# Altium schematic sheet 1_P1.schdoc
size 307 x 218 mm; Symbol: Drawing-Symbol_A4; Device: Drawing-Symbol_A4; Company: 嘉立创EDA; Version: V1.0; Page Size: A4; @Project Name: 瑞萨开发板; @Page Count: 1; @Update Date: 2025-09-14; @Create Date: 2025-09-13; @Schematic Name: Schematic1; @Page No: 1; @Page Name: P1; @Create Time: 13:29:17; @Update Time: 19:17:57; Width: 1170; Height: 825; Region Start: 1; X Region Count: 6; Y Region Count: 4; Blade Width: 10; Title Block Position: 3; @Board Name: Board1
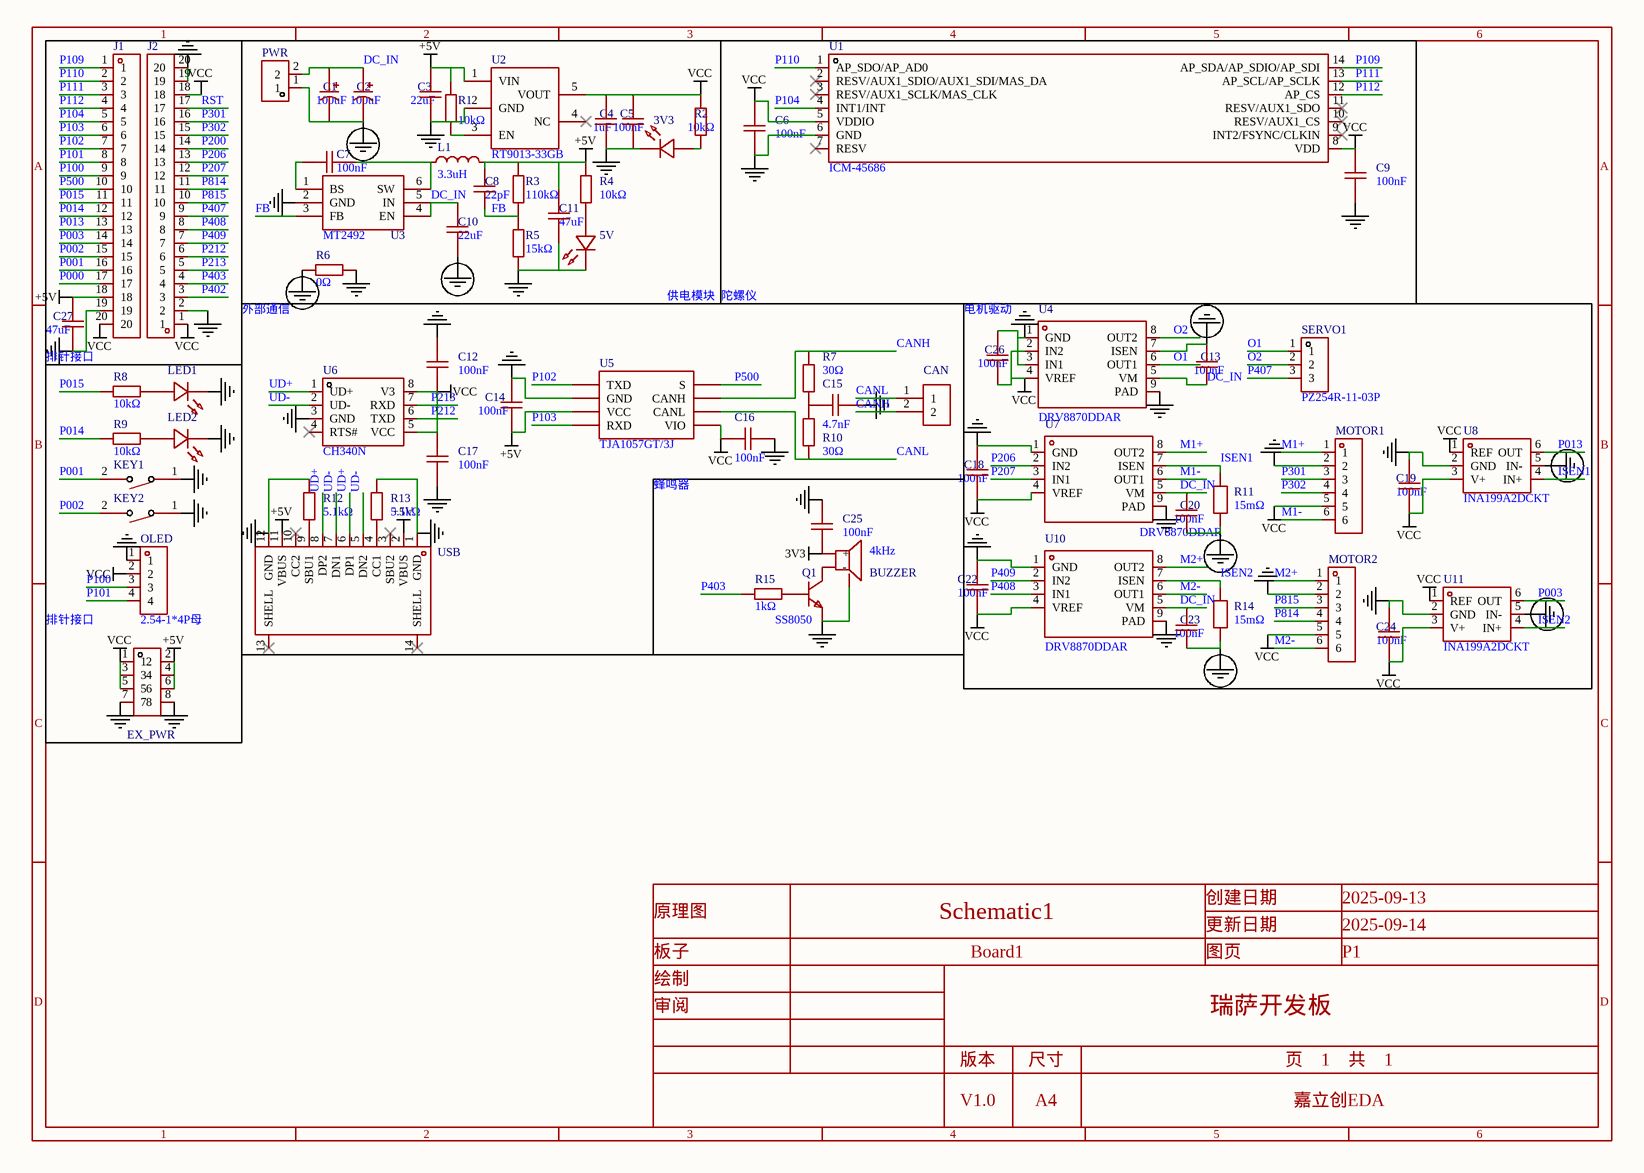
[diagram p0: 1_P1.schdoc]

## Parts
3V3  XL-1608SURC-06  [LED0603-RD_RED]  (value not drawn)
5V  XL-1608SURC-06  [LED0603-RD_RED]  (value not drawn)
BUZZER  4kHz  [BUZ-SMD_L5.0-W5.5-P4.60]
C1  100uF  [CAP-SMD_BD8.1-L8.3-W8.3-LS9.3-FD]
C2  100uF  [CAP-SMD_BD8.1-L8.3-W8.3-LS9.3-FD]
C3  22uF  [C0603]
C4  1uF  [C0603]
C5  100nF  [C0603]
C6  100nF  [C0603]
C7  100nF  [C0603]
C8  22pF  [C0603]
C9  100nF  [C0603]
C10  22uF  [C0805]
C11  47uF  [C0805]
C12  100nF  [C0603]
C13  100nF  [C0805]
C14  100nF  [C0805]
C15  4.7nF  [C0603]
C16  100nF  [C0603]
C17  100nF  [C0603]
C18  100nF  [C0603]
C19  100nF  [C0603]
C20  100nF  [C0805]
C22  100nF  [C0603]
C23  100nF  [C0805]
C24  100nF  [C0603]
C25  100nF  [C0603]
C26  100nF  [C0603]
C27  47uF  [C0805]
CAN  WJ500V-5.08-2P  [CONN-TH_2P-P5.00_WJ500V-5.08-2P]  (value not drawn)
EX_PWR  PZ254V-12-8P  [HDR-TH_8P-P2.54-V-M-R2-C4-S2.54]  (value not drawn)
J1  ZX-PM2.54-1-20PY  [HDR-TH_20P-P2.54-V-F]  (value not drawn)
J2  ZX-PM2.54-1-20PY  [HDR-TH_20P-P2.54-V-F]  (value not drawn)
KEY1  TS-1088-AR02016  [SW-SMD_L3.9-W3.0-P4.45]  (value not drawn)
KEY2  TS-1088-AR02016  [SW-SMD_L3.9-W3.0-P4.45]  (value not drawn)
L1  3.3uH  [IND-SMD_L7.1-W6.6_MJC-0603T]
LED1  XL-1608SURC-06  [LED0603-RD_RED]  (value not drawn)
LED2  XL-1608SURC-06  [LED0603-RD_RED]  (value not drawn)
MOTOR1  ZX-XH2.54-6PWZ  [CONN-TH_6P-P2.50_ZX-XH2.54-6PWZ]  (value not drawn)
MOTOR2  ZX-XH2.54-6PWZ  [CONN-TH_6P-P2.50_ZX-XH2.54-6PWZ]  (value not drawn)
OLED  2.54-1*4P母  [HDR-TH_4P-P2.54-V-F]
PWR  PZ254V-11-02P  [HDR-TH_2P-P2.54-V-M]  (value not drawn)
Q1  SS8050  [SOT-23-3_L2.9-W1.3-P1.90-LS2.4-BR]
R1  10kΩ  [R0603]
R2  10kΩ  [R0603]
R3  110kΩ  [R0402]
R4  10kΩ  [R0603]
R5  15kΩ  [R0402]
R6  0Ω  [R0603]
R7  30Ω  [R0603]
R8  10kΩ  [R0603]
R9  10kΩ  [R0603]
R10  30Ω  [R0603]
R11  15mΩ  [RES-SMD_L6.4-W3.2-R2512]
R12  5.1kΩ  [R0402]
R13  5.1kΩ  [R0402]
R14  15mΩ  [RES-SMD_L6.4-W3.2-R2512]
R15  1kΩ  [R0603]
SERVO1  PZ254R-11-03P  [HDR-TH_3P-P2.54-H-M-W10.4]
U1  ICM-45686  [LGA-14_L3.0-W2.5-P0.50-TL]
U2  RT9013-33GB  [SOT-23-5_L3.0-W1.7-P0.95-LS2.8-BL]
U3  MT2492  [SOT-23-6_L2.9-W1.6-P0.95-LS2.8-BL_3]
U4  DRV8870DDAR  [HSOP-8_L5.0-W4.0-P1.27-LS6.2-BL-EP]
U5  TJA1057GT/3J  [SOIC-8_L4.9-W3.9-P1.27-LS6.0-BL]
U6  CH340N  [SOP-8_L4.9-W3.9-P1.27-LS6.0-BL]
U7  DRV8870DDAR  [HSOP-8_L5.0-W4.0-P1.27-LS6.2-BL-EP]
U8  INA199A2DCKT  [SC-70-6_L2.0-W1.3-P0.65-LS2.1-BR]
U10  DRV8870DDAR  [HSOP-8_L5.0-W4.0-P1.27-LS6.2-BL-EP]
U11  INA199A2DCKT  [SC-70-6_L2.0-W1.3-P0.65-LS2.1-BR]
USB  TYPE-C 16PIN 2MD(073)  [USB-C-SMD_TYPE-C-6PIN-2MD-073]  (value not drawn)

## Blocks framed on the sheet
排针接口: C27 J1 J2
供电模块: 3V3 5V C1-C5 C7 C8 C10 C11 L1 PWR R1-R6 U2 U3
陀螺仪: C6 C9 U1
外部通信: C12 C14-C17 CAN R7 R10 R12 R13 U5 U6 USB
电机驱动: C13 C18-C20 C22-C24 C26 MOTOR1 MOTOR2 R11 R14 SERVO1 U4 U7 U8 U10 U11
排针接口: EX_PWR KEY1 KEY2 LED1 LED2 OLED R8 R9
蜂鸣器: BUZZER C25 Q1 R15

## Nets
3V3: BUZZER.1(+) C25.2
+5V: C3.1 C8.2 C11.2 C14.1 C27.2 EX_PWR.2 EX_PWR.4 EX_PWR.6 J1.18 L1.2 R1.1 R3.2 R4.2 U2.1(VIN) U5.3(VCC) USB.2(VBUS) USB.11(VBUS)
GND: 3V3.1(K) 5V.1(K) BUZZER.3(NC) C3.2 C4.1 C5.1 C6.1 C9.1 C11.1 C12.2 C14.2 C15.2 C16.1 C17.1 C18.2 C19.2 C22.2 C24.2 C25.1 C26.2 C27.1 EX_PWR.7 EX_PWR.8 J1.19 J2.2 J2.19 J2.20 KEY1.1 KEY2.1 LED1.1(K) LED2.1(K) MOTOR1.2 MOTOR2.2 OLED.1 Q1.2(E) R5.1 R6.2 R12.1 R13.1 U1.6(GND) U2.2(GND) U3.2(GND) U4.1(GND) U4.3(IN1) U4.9(PAD) U5.2(GND) U6.3(GND) U7.1(GND) U7.9(PAD) U8.2(GND) U10.1(GND) U10.9(PAD) U11.2(GND) USB.1(GND) USB.12(GND)
PGND: C1.2 C2.2 C10.1 C13.2 C20.1 C23.1 PWR.1 R6.1 R11.1 R14.1 U4.7(ISEN) U8.5(IN-) U11.5(IN-)
VCC: C4.2 C5.2 C6.2 C9.2 C12.1 C16.2 C17.2 C18.1 C19.1 C22.1 C24.1 C26.1 EX_PWR.1 EX_PWR.3 EX_PWR.5 J1.20 J2.1 J2.18 MOTOR1.5 MOTOR2.5 OLED.2 R2.2 U1.5(VDDIO) U1.8(VDD) U2.5(VOUT) U4.2(IN2) U4.4(VREF) U5.5(VIO) U6.5(VCC) U6.8(V3) U7.4(VREF) U8.1(REF) U8.3(V+) U10.4(VREF) U11.1(REF) U11.3(V+)
CANH: CAN.2 R7.2 U5.7(CANH)
CANL: CAN.1 R10.1 U5.6(CANL)
DC_IN: C1.1 C2.1 C10.2 C13.1 C20.2 C23.2 PWR.2 U3.4(EN) U3.5(IN) U4.5(VM) U7.5(VM) U10.5(VM)
FB: C8.1 R3.1 R5.2 U3.3(FB)
ISEN1: R11.2 U7.7(ISEN) U8.4(IN+)
ISEN2: R14.2 U10.7(ISEN) U11.4(IN+)
M1+: MOTOR1.1 U7.8(OUT2)
M1-: MOTOR1.6 U7.6(OUT1)
M2+: MOTOR2.1 U10.8(OUT2)
M2-: MOTOR2.6 U10.6(OUT1)
O1: SERVO1.1 U4.6(OUT1)
O2: SERVO1.2 U4.8(OUT2)
P000: J1.17
P001: J1.16 KEY1.2
P002: J1.15 KEY2.2
P003: J1.14 U11.6(OUT)
P013: J1.13 U8.6(OUT)
P014: J1.12 R9.2
P015: J1.11 R8.2
P100: J1.9 OLED.3
P101: J1.8 OLED.4
P102: J1.7 U5.1(TXD)
P103: J1.6 U5.4(RXD)
P104: J1.5 U1.4(INT1/INT)
P109: J1.1 U1.14(AP_SDA/AP_SDIO/AP_SDI)
P110: J1.2 U1.1(AP_SDO/AP_AD0)
P111: J1.3 U1.13(AP_SCL/AP_SCLK)
P112: J1.4 U1.12(AP_CS)
P200: J2.14
P206: J2.13 U7.2(IN2)
P207: J2.12 U7.3(IN1)
P212: J2.6 U6.6(TXD)
P213: J2.5 U6.7(RXD)
P301: J2.16 MOTOR1.3
P302: J2.15 MOTOR1.4
P402: J2.3
P403: J2.4 R15.1
P407: J2.9 SERVO1.3
P408: J2.8 U10.3(IN1)
P409: J2.7 U10.2(IN2)
P500: J1.10 U5.8(S)
P814: J2.11 MOTOR2.4
P815: J2.10 MOTOR2.3
RST: J2.17
UD+: U6.1(UD+) USB.6(DP1) USB.8(DP2)
UD-: U6.2(UD-) USB.5(DN2) USB.7(DN1)
Net3V3_2: 3V3.2(A) R2.1
Net5V_2: 5V.2(A) R4.1
NetBUZZER_2: BUZZER.2(-) Q1.3(C)
NetC7_1: C7.1 L1.1 U3.6(SW)
NetC7_2: C7.2 U3.1(BS)
NetC15_1: C15.1 R7.1 R10.2
NetLED1_2: LED1.2(A) R8.1
NetLED2_2: LED2.2(A) R9.1
NetQ1_1: Q1.1(B) R15.2
NetR1_2: R1.2 U2.3(EN)
NetR12_2: R12.2 USB.9(SBU1)
NetR13_2: R13.2 USB.4(CC1)

Not connected (* = marked no-connect by the designer): U1 2(RESV/AUX1_SDIO/AUX1_SDI/MAS_DA)* 3(RESV/AUX1_SCLK/MAS_CLK)* 7(RESV)* 9(INT2/FSYNC/CLKIN)* 10(RESV/AUX1_CS)* 11(RESV/AUX1_SDO)*; U2 4(NC)*; U6 4(RTS#)*; USB 3(SBU2)* 10(CC2)* 13(SHELL)* 14(SHELL)*

## Notes on the sheet
- 1
- 2
- 3
- 4
- 5
- 6
- A
- B
- C
- 原理图
- Schematic1
- 创建日期
- 更新日期
- 2025-09-13
- 2025-09-14
- 板子
- 绘制
- Board1
- 图页
- P1
- D
- 审阅
- 版本
- 尺寸
- 瑞萨开发板
- 页    1    共    1
- V1.0
- A4
- 嘉立创EDA

## Library data of the parts
3V3 5V LED1 LED2 = XL-1608SURC-06: Manufacturer: XINGLIGHT(成兴光); Add into BOM: yes; Illumination Color: 红色; Voltage - Forward(Vf): 2.3V; Power(Watts): 50mW; Forward Current: 20mA; Wavelength - Dominant: 620nm~630nm; Peak Wavelength: 625nm; Lens Color: 无色透明透镜; Luminous Intensity: 225mcd; Viewing Angle: 120°; Symbol: XL-1608SURC-06; Device: XL-1608SURC-06; LCSC Part Name: 0603红色贴片式发光二极管; Supplier Part: C965799; Manufacturer Part: XL-1608SURC-06; Supplier Footprint: 0603; JLCPCB Part Class: 扩展库; Datasheet: https://item.szlcsc.com/datasheet/XL-1608SURC-06/1051408.html; Supplier: LCSC; Convert to PCB: yes; Lamp Holder Type: -; Diode Configuration: -; Color Temperature: -; Mounting Style: 正贴; Operating Temperature: -40℃~+85℃
BUZZER = MLT-5020: Manufacturer: 华能; Add into BOM: yes; Driver Circuitry: 无源(外部驱动); Symbol: MLT-5020; Device: MLT-5020; LCSC Part Name: MLT-5020; Supplier Part: C94598; Manufacturer Part: MLT-5020; Supplier Footprint: SMD,5x5mm; JLCPCB Part Class: Extended Part; Datasheet: https://atta.szlcsc.com/upload/public/pdf/source/20210811/111454390007D221D7259018FB170E62.pdf; Supplier: LCSC; Convert to PCB: yes; Technology: 电磁式; Value: 4kHz; Length: 5.2mm; Width: 5.2mm; Height: 2.5mm
C1 C2 = GVE1H107M0810CNVC: Manufacturer: HRK(鸿瑞凯电子); Add into BOM: yes; Tolerance: ±20%; Voltage Rating: 50V; Ripple Current: 300mA@100kHz; Equivalent Series Resistance(ESR): 600mΩ@100kHz; Lifetime: 2000hrs@105℃; Symbol: GVE1H107M0810CNVC; Device: GVE1H107M0810CNVC; LCSC Part Name: 100uF ±20% 50V; Supplier Part: C2983307; Manufacturer Part: GVE1H107M0810CNVC; Supplier Footprint: SMD,D8xL10.5mm; JLCPCB Part Class: 扩展库; Datasheet: https://item.szlcsc.com/datasheet/GVE1H107M0810CNVC/3419593.html; Supplier: LCSC; Convert to PCB: yes; Value: 100uF; Diameter: 8mm; Height - Seated (Max): 10.5mm; Operating Temperature: -55℃~+105℃
C3 = CL10A226MO7JZNC: Manufacturer: SAMSUNG(三星); Add into BOM: yes; Tolerance: ±20%; Voltage Rating: 16V; Temperature Coefficient: X5R; Symbol: CL10A226MO7JZNC; Device: CL10A226MO7JZNC; LCSC Part Name: 22uF ±20% 16V; Supplier Part: C2762594; Manufacturer Part: CL10A226MO7JZNC; Supplier Footprint: 0603; JLCPCB Part Class: 扩展库; Datasheet: https://item.szlcsc.com/datasheet/CL10A226MO7JZNC/2889856.html; Supplier: LCSC; Convert to PCB: yes; Value: 22uF
C4 = CL10A105KB8NNNC: Manufacturer: SAMSUNG(三星); Add into BOM: yes; Tolerance: ±10%; Voltage Rating: 50V; Temperature Coefficient: X5R; Symbol: CL10A105KB8NNNC; Device: CL10A105KB8NNNC; LCSC Part Name: 1uF ±10% 50V; Supplier Part: C15849; Manufacturer Part: CL10A105KB8NNNC; Supplier Footprint: 0603; JLCPCB Part Class: 基础库; Datasheet: https://item.szlcsc.com/datasheet/CL10A105KB8NNNC/16531.html; Supplier: LCSC; Convert to PCB: yes; Value: 1uF
C5-C7 C9 C12 C16-C19 C22 C24-C26 = CGA0603X7R104K500JT: Manufacturer: HRE(芯声); Add into BOM: yes; Tolerance: ±10%; Voltage Rating: 50V; Temperature Coefficient: X7R; Symbol: CGA0603X7R104K500JT; Device: CGA0603X7R104K500JT; LCSC Part Name: 100nF ±10% 50V; Supplier Part: C6119867; Manufacturer Part: CGA0603X7R104K500JT; Supplier Footprint: 0603; JLCPCB Part Class: 扩展库; Datasheet: https://atta.szlcsc.com/upload/public/pdf/source/20250103/C44077DA9E7B3EFAE02F22B6D3D1CBC9.pdf; Supplier: LCSC; Convert to PCB: yes; Value: 100nF
  C6 C9 C12 C16 C17 C25: Voltage Rated: 50V
C8 = CL10C220JB8NNNC: Manufacturer: SAMSUNG(三星); Add into BOM: yes; Tolerance: ±5%; Voltage Rating: 50V; Temperature Coefficient: C0G; Symbol: CL10C220JB8NNNC; Device: CL10C220JB8NNNC; LCSC Part Name: 22pF ±5% 50V; Supplier Part: C1653; Manufacturer Part: CL10C220JB8NNNC; Supplier Footprint: 0603; JLCPCB Part Class: 基础库; Datasheet: https://item.szlcsc.com/datasheet/CL10C220JB8NNNC/2005.html; Supplier: LCSC; Convert to PCB: yes; Value: 22pF
C10 = CL21A226MAQNNNE: Manufacturer: SAMSUNG(三星); Add into BOM: yes; Tolerance: ±20%; Voltage Rating: 25V; Temperature Coefficient: X5R; Symbol: CL21A226MAQNNNE; Device: CL21A226MAQNNNE; LCSC Part Name: 22uF ±20% 25V; Supplier Part: C45783; Manufacturer Part: CL21A226MAQNNNE; Supplier Footprint: 0805; JLCPCB Part Class: 基础库; Datasheet: https://item.szlcsc.com/datasheet/CL21A226MAQNNNE/46786.html; Supplier: LCSC; Convert to PCB: yes; Value: 22uF
C11 C27 = CGA0805X5R476M100MT: Manufacturer: HRE(芯声); Add into BOM: yes; Tolerance: ±20%; Voltage Rating: 10V; Temperature Coefficient: X5R; Symbol: CGA0805X5R476M100MT; Device: CGA0805X5R476M100MT; LCSC Part Name: 47uF ±20% 10V; Supplier Part: C6119904; Manufacturer Part: CGA0805X5R476M100MT; Supplier Footprint: 0805; JLCPCB Part Class: 扩展库; Supplier: LCSC; Convert to PCB: yes; Value: 47uF
C13 C20 C23 = CL21B104KBCNNNC: Manufacturer: SAMSUNG(三星); Add into BOM: yes; Tolerance: ±10%; Voltage Rating: 50V; Temperature Coefficient: X7R; Symbol: CL21B104KBCNNNC; Device: CL21B104KBCNNNC; LCSC Part Name: 100nF ±10% 50V; Supplier Part: C1711; Manufacturer Part: CL21B104KBCNNNC; Supplier Footprint: 0805; JLCPCB Part Class: 扩展库; Datasheet: https://item.szlcsc.com/datasheet/CL21B104KBCNNNC/2063.html; Supplier: LCSC; Convert to PCB: yes; Value: 100nF
C14 = CC0805KRX7R9BB104: Manufacturer: YAGEO(国巨); Add into BOM: yes; Tolerance: ±10%; Voltage Rated: 50V; Temperature Coefficient: X7R; Symbol: CC0805KRX7R9BB104; Device: CC0805KRX7R9BB104; LCSC Part Name: 100nF ±10% 50V; Supplier Part: C49678; Manufacturer Part: CC0805KRX7R9BB104; Supplier Footprint: 0805; JLCPCB Part Class: Basic Part; Datasheet: https://atta.szlcsc.com/upload/public/pdf/source/20180224/C181747_15194369449651363981.pdf; Supplier: LCSC; Convert to PCB: yes; Value: 100nF
C15 = CGA0603X7R472K500JT: Manufacturer: HRE(芯声); Add into BOM: yes; Tolerance: ±10%; Voltage Rating: 50V; Temperature Coefficient: X7R; Symbol: CGA0603X7R472K500JT; Device: CGA0603X7R472K500JT; LCSC Part Name: 4.7nF ±10% 50V; Supplier Part: C7503499; Manufacturer Part: CGA0603X7R472K500JT; Supplier Footprint: 0603; JLCPCB Part Class: Extended Part; Supplier: LCSC; Convert to PCB: yes; Value: 4.7nF
CAN = WJ500V-5.08-2P: Manufacturer: KANGNEX(康奈克斯电气); Symbol: WJ500V-5.08-2P-14-00A; Add into BOM: yes; Structure: 1x2P; Pitch: 5.08mm; Current Rating (Max): 18A; Voltage Rating (Max): 250V; Wire Gauge - AWG: 14~30; Wire Gauge - mm2: 2.5; Number of PINs Per Row: 2; Screw Specification: M2.5; Device: WJ500V-5.08-2P; LCSC Part Name: 1x2P 5.08mm 直插 排数:1 每排P数:2; Supplier Part: C8465; Manufacturer Part: WJ500V-5.08-2P; Supplier Footprint: 插件,P=5.08mm; JLCPCB Part Class: Extended Part; Datasheet: https://atta.szlcsc.com/upload/public/pdf/source/20191225/C8465_02D34CE5B5B4A53DF5891601D97FA9F4.pdf; Supplier: LCSC; Convert to PCB: yes; Color: 绿色; Mounting Style: 直插; Number of Pins: 2P; Number of Rows: 1; Contact Material: -; Contact Plating: -; Operating Temperature Range: -40℃~+105℃; Soldering Temperature(Max): -
EX_PWR = PZ254V-12-8P: Manufacturer: XFCN(兴飞); Add into BOM: yes; Pin Structure: 2x4P; Pitch: 2.54mm; Circluar Pins/Square Pins: 方针; Symbol: PZ254V-12-8P; Device: PZ254V-12-8P; LCSC Part Name: 2x4P 间距:2.54mm 方针 直插; Supplier Part: C492421; Manufacturer Part: PZ254V-12-8P; Supplier Footprint: 插件,P=2.54mm; JLCPCB Part Class: Extended Part; Datasheet: https://atta.szlcsc.com/upload/public/pdf/source/20200309/C492421_DC8A206AF99CD7755BD4A5B0BC48200B.pdf; Supplier: LCSC; Convert to PCB: yes; Row Spacing: 2.54mm; Mounting Type: 直插; Number of Rows: 双排; Number of Pins: 8P; Current Rating: -; Voltage Rating (Max): -; Length of Mating Pin: 6mm; Insulation Height: 2.5mm; Length of End Connection Pin: 3mm; Contact Material: 黄铜; Contact Plating: -; Operating Temperature: -40℃~+105℃; Color: 黑色
J1 J2 = ZX-PM2.54-1-20PY: Manufacturer: Megastar(兆星); Add into BOM: yes; Holes Structure: 1x20P; Pitch: 2.54mm; Circular Hole / Square Hole: 方孔; Number of Positions: 20P; Current Rating: 3A; Holes Direction: 顶部; PIN Length: 3.2mm; Symbol: ZX-PM2.54-1-20PY; Device: ZX-PM2.54-1-20PY; LCSC Part Name: 1x20P 间距:2.54mm 直插; Supplier Part: C7499336; Manufacturer Part: ZX-PM2.54-1-20PY; Supplier Footprint: 插件,P=2.54mm; JLCPCB Part Class: 扩展库; Datasheet: https://item.szlcsc.com/datasheet/ZX-PM2.54-1-20PY/8573997.html; Supplier: LCSC; Convert to PCB: yes; Row Spacing: -; Mounting Type: 直插; Number of Rows: 单排; Voltage Rating (Max): -; Insulation Height: 8.5mm; Contact Material: -; Contact Plating: 金; Operating Temperature: -40℃~+105℃
KEY1 KEY2 = TS-1088-AR02016: Manufacturer: XUNPU(讯普); Add into BOM: yes; Circuit: 单刀单掷; Actuator Style: 圆形按钮; Operating Force: 160gf; Switch Length: 4mm; Switch Width: 3mm; Switch Height: 2mm; Strike Gundam: 不带; Contact Current: 50mA; Voltage Rating (DC): 12V; Insulation Resistance: 100MΩ; Actuator/Cap Color: 黑色; Pin Style: SMD接片; Mechanical Life: 10万次; Symbol: TS-1088-AR02016; Device: TS-1088-AR02016; LCSC Part Name: 4*3*2mm 立贴 轻触开关; Supplier Part: C720477; Manufacturer Part: TS-1088-AR02016; Supplier Footprint: SMD; JLCPCB Part Class: Basic Part; Datasheet: https://atta.szlcsc.com/upload/public/pdf/source/20200810/C720475_60D09DD6C54279ADDB2DC25100F1CC11.pdf; Supplier: LCSC; Convert to PCB: yes; Mounting Style: 立贴; Operating Temperature: -30℃~+80℃
L1 = CXP0630-3R3M-AG(3.3uh): Manufacturer: DMBJ(振宝佳); Add into BOM: yes; Tolerance: ±20%; Rated Current: 6.5A; Saturation Current (Isat): 9.5A; DC Resistance (DCR): 26mΩ; Type: 一体成型电感; Symbol: CXP0630-3R3M-AG(3.3UH); Device: CXP0630-3R3M-AG(3.3uh); LCSC Part Name: 3.3uH ±20% 9.5A; Supplier Part: C7461359; Manufacturer Part: CXP0630-3R3M-AG(3.3uh); Supplier Footprint: 0630; JLCPCB Part Class: 扩展库; Datasheet: https://atta.szlcsc.com/upload/public/pdf/source/20230706/7F3A5B39C5AD80A91C9FA782B54A296B.pdf; Supplier: LCSC; Convert to PCB: yes; Value: 3.3uH
MOTOR1 MOTOR2 = ZX-XH2.54-6PWZ: Manufacturer: Megastar(兆星); Add into BOM: yes; Pins Structure: 1x6P; Pitch: 2.5mm; Reference Series: XH; Number of PINs Per Row: 6; Rated Current: 3A; Rated Voltage (Max): 250V; Plastic Material: PA66; Flame Retardant Rating: UL94V-0; Z-Height of the Board: 5.9mm; X-Length of Bottom Edge on Board (Spacing Line): 17.5mm; Y-Width of Bottom Edge on Board: 7.32mm; Symbol: ZX-XH2.54-6PWZ; Device: ZX-XH2.54-6PWZ; LCSC Part Name: 1x6P 间距:2.5mm 弯插 系列:XH; Supplier Part: C7429645; Manufacturer Part: ZX-XH2.54-6PWZ; Supplier Footprint: 弯插,P=2.5mm; JLCPCB Part Class: Extended Part; Datasheet: https://atta.szlcsc.com/upload/public/pdf/source/20230619/9057EB94260093B1525D11E652DE2D7A.pdf; Supplier: LCSC; Convert to PCB: yes; Mounting Type: 弯插; Number of Pins: 6P; Number of Rows: 1; Row Spacing: -; Contact Material: 黄铜; Contact Plating: 锡; Operating Temperature: -25℃~+85℃; Supplementary Features: -; Color: 白色
OLED = 2.54-1*4P母: Manufacturer: BOOMELE(博穆精密); Add into BOM: yes; Holes Structure: 1x4P; Pitch: 2.54mm; Circular Hole / Square Hole: 方孔; Number of Positions: 4P; Current Rating: 3A; Holes Direction: 顶部; Symbol: 2.54-1*4P母; Device: 2.54-1*4P母; LCSC Part Name: 间距:2.54mm 1x4P 直插; Supplier Part: C2718488; Manufacturer Part: 2.54-1*4P母; Supplier Footprint: 插件,P=2.54mm; JLCPCB Part Class: Extended Part; Datasheet: https://item.szlcsc.com/datasheet/2.54-1*4P%25E6%25AF%258D/2834502.html; Supplier: LCSC; Convert to PCB: yes; Row Spacing: -; Mounting Type: 直插; Number of Rows: 单排; Voltage Rating (Max): -; Insulation Height: -; Contact Material: 青铜; Contact Plating: -; Operating Temperature: -40℃~+105℃
PWR = PZ254V-11-02P: Manufacturer: XFCN(兴飞); Add into BOM: yes; Pin Structure: 1x2P; Pitch: 2.54mm; Circluar Pins/Square Pins: 方针; Symbol: PZ254V-11-02P; Device: PZ254V-11-02P; LCSC Part Name: 1x2P 间距:2.54mm 方针 直插; Supplier Part: C492401; Manufacturer Part: PZ254V-11-02P; Supplier Footprint: 插件,P=2.54mm; JLCPCB Part Class: Extended Part; Datasheet: https://item.szlcsc.com/datasheet/PZ254V-11-02P/502957.html; Supplier: LCSC; Convert to PCB: yes; Row Spacing: -; Mounting Type: 直插; Number of Rows: 单排; Number of Pins: 2P; Current Rating: -; Voltage Rating (Max): -; Length of Mating Pin: 6mm; Insulation Height: 2.5mm; Length of End Connection Pin: 3mm; Contact Material: 黄铜; Contact Plating: -; Operating Temperature: -40℃~+105℃; Color: 黑色
Q1 = SS8050_C7420370: Manufacturer: 宏嘉诚; Add into BOM: yes; type: NPN; Current - Collector(Ic): 1.5A; Collector - Emitter Voltage VCEO: 25V; Pd - Power Dissipation: 300mW; DC Current Gain: 120@100mA,1.0V; Transition frequency(fT): 100MHz; Current - Collector Cutoff: 100nA; Vce Saturation(VCE(sat)): 500mV; Symbol: SS8050_C7420370; Device: SS8050_C7420370; LCSC Part Name: H档 200-350; Supplier Part: C7420370; Manufacturer Part: SS8050; Supplier Footprint: SOT-23; JLCPCB Part Class: Extended Part; Datasheet: https://atta.szlcsc.com/upload/public/pdf/source/20250205/5DB94E86981B5B1A1866D18E379C0D4F.pdf; Supplier: LCSC; Convert to PCB: yes; Operating Temperature: -55℃~+150℃
R1 R2 R4 R8 R9 = 0603WAF1002T5E: Manufacturer: UNI-ROYAL(厚声); Add into BOM: yes; Tolerance: ±1%; Power(Watts): 100mW; Voltage-Supply(Max): 75V; Temperature Coefficient: ±100ppm/℃; Symbol: 0603WAF1002T5E; Device: 0603WAF1002T5E; LCSC Part Name: 厚膜电阻 10kΩ ±1% 100mW; Supplier Part: C25804; Manufacturer Part: 0603WAF1002T5E; Supplier Footprint: 0603; JLCPCB Part Class: 基础库; Datasheet: https://item.szlcsc.com/datasheet/0603WAF1002T5E/26547.html; Supplier: LCSC; Convert to PCB: yes; Type: 厚膜电阻; Value: 10kΩ; Operating Temperature: -55℃~+155℃
R3 = RC0402FR-07110KL: Manufacturer: YAGEO(国巨); Add into BOM: yes; Tolerance: ±1%; Power(Watts): 62.5mW; Voltage-Supply(Max): 50V; Temperature Coefficient: ±100ppm/℃; Symbol: RC0402FR-07110KL; Device: RC0402FR-07110KL; LCSC Part Name: 厚膜电阻 110kΩ ±1% 62.5mW; Supplier Part: C138065; Manufacturer Part: RC0402FR-07110KL; Supplier Footprint: 0402; JLCPCB Part Class: 扩展库; Datasheet: https://item.szlcsc.com/datasheet/RC0402FR-07110KL/149381.html; Supplier: LCSC; Convert to PCB: yes; Type: 厚膜电阻; Value: 110kΩ; Operating Temperature: -55℃~+155℃
R5 = 0402WGF1502TCE: Manufacturer: UNI-ROYAL(厚声); Add into BOM: yes; Tolerance: ±1%; Power(Watts): 62.5mW; Overload Voltage (Max): 50V; Temperature Coefficient: ±100ppm/℃; Symbol: 0402WGF1502TCE; Device: 0402WGF1502TCE; LCSC Part Name: 15kΩ ±1% 62.5mW 厚膜电阻; Supplier Part: C25756; Manufacturer Part: 0402WGF1502TCE; Supplier Footprint: 0402; JLCPCB Part Class: 基础库; Datasheet: https://atta.szlcsc.com/upload/public/pdf/source/20200306/C422600_1E6D84923E4A46A82E41ADD87F860B5C.pdf; Supplier: LCSC; Convert to PCB: yes; Type: 厚膜电阻; Value: 15kΩ; Operating Temperature Range: -55℃~+155℃
R6 = 0603WAF0000T5E: Manufacturer: UNI-ROYAL(厚声); Add into BOM: yes; Tolerance: ±1%; Power(Watts): 100mW; Voltage-Supply(Max): 75V; Symbol: 0603WAF0000T5E; Device: 0603WAF0000T5E; LCSC Part Name: 0Ω ±1% 100mW 厚膜电阻; Supplier Part: C21189; Manufacturer Part: 0603WAF0000T5E; Supplier Footprint: 0603; JLCPCB Part Class: 基础库; Datasheet: https://item.szlcsc.com/datasheet/0603WAF0000T5E/21903.html; Supplier: LCSC; Convert to PCB: yes; Type: 厚膜电阻; Value: 0Ω; Temperature Coefficient: -; Operating Temperature: -55℃~+155℃
R7 R10 = 0603WAF300JT5E: Manufacturer: UNI-ROYAL(厚声); Add into BOM: yes; Tolerance: ±1%; Power(Watts): 100mW; Overload Voltage (Max): 75V; Temperature Coefficient: ±100ppm/℃; Symbol: 0603WAF300JT5E; Device: 0603WAF300JT5E; LCSC Part Name: 30Ω ±1% 100mW 厚膜电阻; Supplier Part: C22985; Manufacturer Part: 0603WAF300JT5E; Supplier Footprint: 0603; JLCPCB Part Class: Extended Part; Datasheet: https://atta.szlcsc.com/upload/public/pdf/source/20200306/C422600_1E6D84923E4A46A82E41ADD87F860B5C.pdf; Supplier: LCSC; Convert to PCB: yes; Type: 厚膜电阻; Value: 30Ω; Operating Temperature Range: -55℃~+155℃
R11 R14 = JER2512F3R015: Manufacturer: JIERR(捷而瑞); Add into BOM: yes; Tolerance: ±1%; Power(Watts): 3W; Temperature Coefficient: ±50ppm/℃; Symbol: JER2512F3R015; Device: JER2512F3R015; LCSC Part Name: 15mΩ 3W 2512 ±1%; Supplier Part: C46634462; Manufacturer Part: JER2512F3R015; Supplier Footprint: 2512; JLCPCB Part Class: 扩展库; Datasheet: https://item.szlcsc.com/datasheet/JER2512F3R015/48788264.html; Supplier: LCSC; Convert to PCB: yes; Type: 采样电阻；合金电阻; Value: 15mΩ
R12 R13 = 0402WGF5101TCE: Manufacturer: UNI-ROYAL(厚声); Add into BOM: yes; Tolerance: ±1%; Power(Watts): 62.5mW; Overload Voltage (Max): 50V; Temperature Coefficient: ±100ppm/℃; Symbol: 0402WGF5101TCE; Device: 0402WGF5101TCE; LCSC Part Name: 5.1kΩ ±1% 62.5mW 厚膜电阻; Supplier Part: C25905; Manufacturer Part: 0402WGF5101TCE; Supplier Footprint: 0402; JLCPCB Part Class: Basic Part; Datasheet: https://atta.szlcsc.com/upload/public/pdf/source/20200306/C422600_1E6D84923E4A46A82E41ADD87F860B5C.pdf; Supplier: LCSC; Convert to PCB: yes; Type: 厚膜电阻; Value: 5.1kΩ; Operating Temperature Range: -55℃~+155℃
R15 = 0603WAF1001T5E: Manufacturer: UNI-ROYAL(厚声); Add into BOM: yes; Tolerance: ±1%; Power(Watts): 100mW; Overload Voltage (Max): 75V; Temperature Coefficient: ±100ppm/℃; Symbol: 0603WAF1001T5E; Device: 0603WAF1001T5E; LCSC Part Name: 1kΩ ±1% 100mW 厚膜电阻; Supplier Part: C21190; Manufacturer Part: 0603WAF1001T5E; Supplier Footprint: 0603; JLCPCB Part Class: Basic Part; Datasheet: https://atta.szlcsc.com/upload/public/pdf/source/20200306/C422600_1E6D84923E4A46A82E41ADD87F860B5C.pdf; Supplier: LCSC; Convert to PCB: yes; Type: 厚膜电阻; Value: 1kΩ; Operating Temperature Range: -55℃~+155℃
SERVO1 = PZ254R-11-03P: Manufacturer: XFCN(兴飞); Add into BOM: yes; Pin Structure: 1x3P; Pitch: 2.54mm; Circluar Pins/Square Pins: 方针; Symbol: PZ254R-11-03P; Device: PZ254R-11-03P; LCSC Part Name: 1x3P 间距:2.54mm 方针 弯插; Supplier Part: C492411; Manufacturer Part: PZ254R-11-03P; Supplier Footprint: 弯插,P=2.54mm; JLCPCB Part Class: 扩展库; Datasheet: https://item.szlcsc.com/datasheet/PZ254R-11-03P/502967.html; Supplier: LCSC; Convert to PCB: yes; Row Spacing: -; Mounting Type: 弯插; Number of Rows: 单排; Number of Pins: 3P; Current Rating: -; Voltage Rating (Max): -; Length of Mating Pin: 6mm; Insulation Height: 2.5mm; Contact Material: 黄铜; Contact Plating: -; Operating Temperature: -40℃~+105℃; Color: 黑色
U1 = ICM-45686: Manufacturer: TDK InvenSense(应美盛); Add into BOM: yes; Symbol: ICM-45686; Device: ICM-45686; LCSC Part Name: ICM-45686; Supplier Part: C22459454; Manufacturer Part: ICM-45686; Supplier Footprint: LGA-14(3x2.5); JLCPCB Part Class: Extended Part; Datasheet: https://atta.szlcsc.com/upload/public/pdf/source/20240704/ABAB537AD22E53DEE8E4ED28732AF5C9.pdf; Supplier: LCSC; Convert to PCB: yes
U2 = RT9013-33GB: Manufacturer: RICHTEK(立锜); Add into BOM: yes; Output Type: 固定; Voltage - Supply: 5.5V; Output Voltage: 3.3V; Output Current: 500mA; Power Supply Rejection Ratio (PSRR): 50dB@(10kHz); Voltage Dropout: 400mV@(500mA); standby current: 25uA; Noise: 30uVrms; Output Configuration: 正极; Number of Outputs: 1; Symbol: RT9013-33GB; Device: RT9013-33GB; LCSC Part Name: 输入5.5V 输出3.3V 500mA; Supplier Part: C47773; Manufacturer Part: RT9013-33GB; Supplier Footprint: SOT-23-5; JLCPCB Part Class: 扩展库; Datasheet: https://item.szlcsc.com/datasheet/RT9013-33GB/48778.html; Supplier: LCSC; Convert to PCB: yes; Features: 带使能；过热保护；过流保护; Operating Temperature: -40℃~+125℃@(Tj)
U3 = MT2492: Manufacturer: 西安航天民芯; Add into BOM: yes; Function: 降压型; Voltage - Supply: 4.5V~16V; Output Current: 2A; Frequency - Switching: 600kHz; Synchronous Rectifier: 是; Number of Outputs: 1; Topology: 降压式; Switch tube (built-in/external): 内置; Symbol: MT2492; Device: MT2492; LCSC Part Name: 2A高效同步降压转换器; Supplier Part: C89358; Manufacturer Part: MT2492; Supplier Footprint: SOT-23-6; JLCPCB Part Class: 扩展库; Datasheet: https://atta.szlcsc.com/upload/public/pdf/source/20221209/5C81DA9662873D3A116170FFBF63E49D.pdf; Supplier: LCSC; Convert to PCB: yes; Output Type: -; Output Voltage: -; Operating Temperature: -40℃~+85℃; Quiescent Current: -
U4 U7 U10 = DRV8870DDAR: Manufacturer: TI(德州仪器); Add into BOM: yes; Peak Current: 3.6A; RDS(on): 565mΩ; Symbol: DRV8870DDAR; Device: DRV8870DDAR; LCSC Part Name: 刷式直流电机驱动器（PWM控制）; Supplier Part: C86590; Manufacturer Part: DRV8870DDAR; Supplier Footprint: HSOP-8-EP; JLCPCB Part Class: 扩展库; Datasheet: https://www.ti.com/cn/lit/gpn/drv8870; Supplier: LCSC; Convert to PCB: yes; Output Current: -; Voltage - Supply: -; Operating Temperature: -40℃~+125℃
U5 = TJA1057GT/3J: Manufacturer: NXP(恩智浦); Add into BOM: yes; Data Rate: 5Mbps; Supply Voltage: 4.75V~5.25V; Symbol: TJA1057GT/3J; Device: TJA1057GT/3J; LCSC Part Name: 5Mbps 4.75V~5.25V; Supplier Part: C112947; Manufacturer Part: TJA1057GT/3J; Supplier Footprint: SOIC-8; JLCPCB Part Class: Extended Part; Datasheet: https://atta.szlcsc.com/upload/public/pdf/source/20170606/1496716409752.pdf; Supplier: LCSC; Convert to PCB: yes; Type: 收发器; Operating Temperature: -40℃~+150℃
U6 = CH340N: Manufacturer: WCH(南京沁恒); Symbol: CH340N_C2977777; Add into BOM: yes; Applications Function: USB转串口; Protocol: USB 2.0; Number of Channels: 1; Voltage - Supply: 3.3V；5V; Data Rate: 2Mbps; Device: CH340N; LCSC Part Name: USB2.0芯片CH340; Supplier Part: C2977777; Manufacturer Part: CH340N; Supplier Footprint: SOP-8; JLCPCB Part Class: Extended Part; Datasheet: https://atta.szlcsc.com/upload/public/pdf/source/20240313/115CDE92081B1D6CB446704AD5D0F5F2.pdf; Supplier: LCSC; Convert to PCB: yes; Operating Temperature: -20℃~+70℃
U8 U11 = INA199A2DCKT: Manufacturer: TI(德州仪器); Add into BOM: yes; Supply Voltage: -300mV~26V; Supply Current: 356uA; Symbol: INA199A2DCKT; Device: INA199A2DCKT; LCSC Part Name: INA199A2DCKT; Supplier Part: C2653850; Manufacturer Part: INA199A2DCKT; Supplier Footprint: SC-70-6; JLCPCB Part Class: 扩展库; Datasheet: https://www.ti.com/cn/lit/gpn/ina199; Supplier: LCSC; Convert to PCB: yes; Operating Temperature: -40℃~+125℃
USB = TYPE-C 16PIN 2MD(073): Manufacturer: SHOU HAN(首韩); Add into BOM: yes; Gender: 母; Number of Contacts: 16P; Number of Ports: 1; Current Rating-Power: 3A; Voltage Rating: 5V; Connect-Disconnect Life: 5千次; Detection color: 黑色; Current Rating - Power (Max): 5A; Symbol: TYPE-C 16PIN 2MD(073); Device: TYPE-C 16PIN 2MD(073); LCSC Part Name: Type-C 母 卧贴; Supplier Part: C2765186; Manufacturer Part: TYPE-C 16PIN 2MD(073); Supplier Footprint: SMD; JLCPCB Part Class: 扩展库; Datasheet: https://item.szlcsc.com/datasheet/TYPE-C%252016PIN%25202MD(073)/2901843.html; Supplier: LCSC; Convert to PCB: yes; Connector Type: Type-C; Protocol Standard: -; Mounting Type: 卧贴; Supplementary Features: -; Center Height: -; Length: -; Operating Temperature: -25℃~+85℃; Standard: USB 3.1; Mounting Style: 卧贴; Operating Temperature Range: -25℃~+85℃; Rated Voltage (Max): 5V; Core Colour: 黑色